# EasyEDA schematic SCH_ServoDebug.json
TITLE: Sheet_1; REV: 1.0; Date: 2022-12-17; Sheet: 1/1; Drawn By: MUSHIBO; Company: Your Company
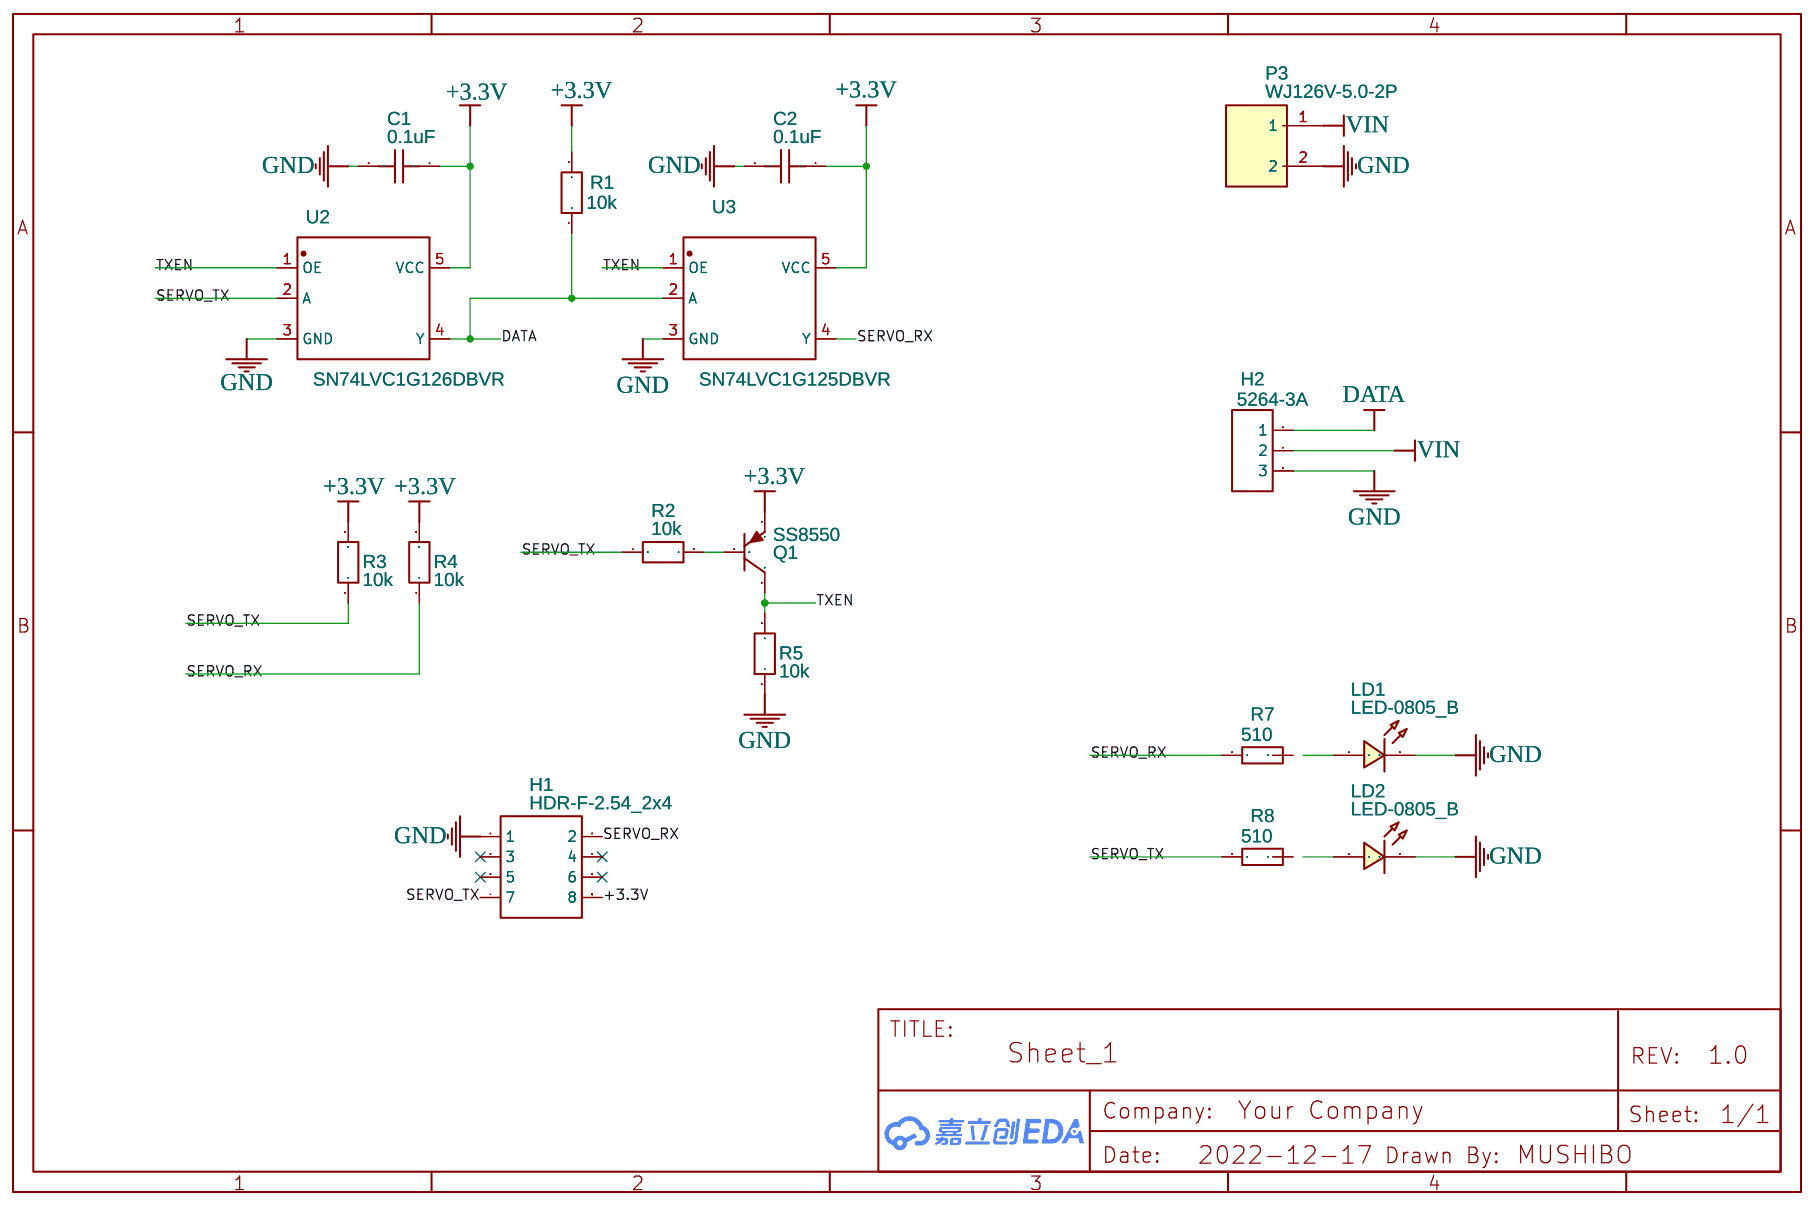
[diagram p0: schematic sheet]

## Parts
C1  0.1uF  [C0805]
C2  0.1uF  [C0805]
H1  HDR-F-2.54_2x4  [HDR-F-2.54_2X4]
H2  5264-3A  [5264-3A]
LD1  LED-0805_B  [LED0805_BLUE]
LD2  LED-0805_B  [LED0805_BLUE]
P3  WJ126V-5.0-2P  [CONN-TH_WJ126V-5.0-2P]
Q1  SS8550  [SOT-23_L2.9-W1.3-P0.95-LS2.4-BR]
R1  10k  [R0805]
R2  10k  [R0805]
R3  10k  [R0805]
R4  10k  [R0805]
R5  10k  [R0805]
R7  510  [R0805]
R8  510  [R0805]
U2  SN74LVC1G126DBVR  [SOT-23-5_L3.0-W1.7-P0.95-LS2.8-BR]
U3  SN74LVC1G125DBVR  [SOT-23-5_L3.0-W1.7-P0.95-LS2.8-BR]

## Library data of the parts
C1 C2 = C_0805_US: Supplier Part: C49678; Supplier: LCSC; Contributor: LCEDA_Lib; Manufacturer Part: CC0805KRX7R9BB104; Manufacturer: YAGEO
H1 = HDR-F-2.54_2x4: Supplier Part: C239344; Supplier: LCSC; Contributor: LCEDA_Lib
H2 = HDR-F-2.54_1x3: Supplier Part: C146133; Supplier: LCSC; Contributor: LCEDA_Lib
LD1 LD2 = LED-0805_B: Manufacturer: 方舟 ARKLED; Manufacturer Part: D-B080508B1-KS2; Supplier Part: C108412; Contributor: LCEDA_Lib
P3 = WJ126V-5.0-2P: Supplier: LCSC; Manufacturer: ReliaPro; Supplier Part: C8404; JLCPCB Part Class: Extended Part
Q1 = SS8550_C444726: Supplier: LCSC; Supplier Part: C444726; Manufacturer: Slkor(SLKORMICRO Elec.); Contributor: LCSC
R1-R4 = R_0805_EU: Supplier Part: C17414; Supplier: LCSC; Contributor: LCEDA_Lib; Manufacturer Part: 0805W8F1002T5E; Manufacturer: UniOhm
R5 = R_0805_EU: Supplier Part: C4328; Supplier: LCSC; Contributor: LCEDA_Lib; Manufacturer Part: 0805W8F2002T5E; Manufacturer: UniOhm
R7 R8 = Resistor: Supplier: LCSC; Supplier Part: C17414; Manufacturer: UniOhm; Manufacturer Part: 0805W8F1002T5E
U2 U3 = SN74LVC1G125DBVR: Supplier: LCSC; Manufacturer: TI; image: //image.lceda.cn/szlcsc/C23654.jpg; Supplier Part: C23654; LCSC Assembly: Yes; SMT Type: Extend

## Nets
+3.3V: C1.1 C2.1 H1.8 Q1.2(E) R1.2 R3.2 R4.2 U2.5(VCC) U3.5(VCC)
GND: C1.2 C2.2 H1.1 H2.3 LD1.2 LD2.2 P3.2 R5.1 U2.3(GND) U3.3(GND)
VIN: H2.2 P3.1
DATA: H2.1 R1.1 U2.4(Y) U3.2(A)
SERVO_RX: H1.2 R4.1 R7.1 U3.4(Y)
SERVO_TX: H1.7 R2.1 R3.1 R8.1 U2.2(A)
TXEN: Q1.3(C) R5.2 U2.1(OE) U3.1(OE)
Net-(LD1-1): LD1.1 R7.2
Net-(LD2-1): LD2.1 R8.2
Net-(Q1-1): Q1.1(B) R2.2

Not connected (* = marked no-connect by the designer): H1 3* 4* 5* 6*
